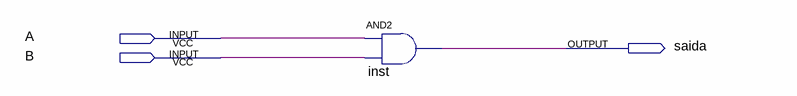
[diagram p0: schematic sheet]
// Quartus schematic introducao_FPGA.bdf as structural Verilog: 1 symbols, 3 pins
module introducao_FPGA (
  input  A,
  input  B,
  output saida
);

  and inst (saida, A, B);
endmodule
